# EAGLE schematic Pinscape Pico Expansion Board - DIY Friendly Main - Soldered Pico (EAGLE 7.7.0)

## Sheet 1 of 11: Main Pico
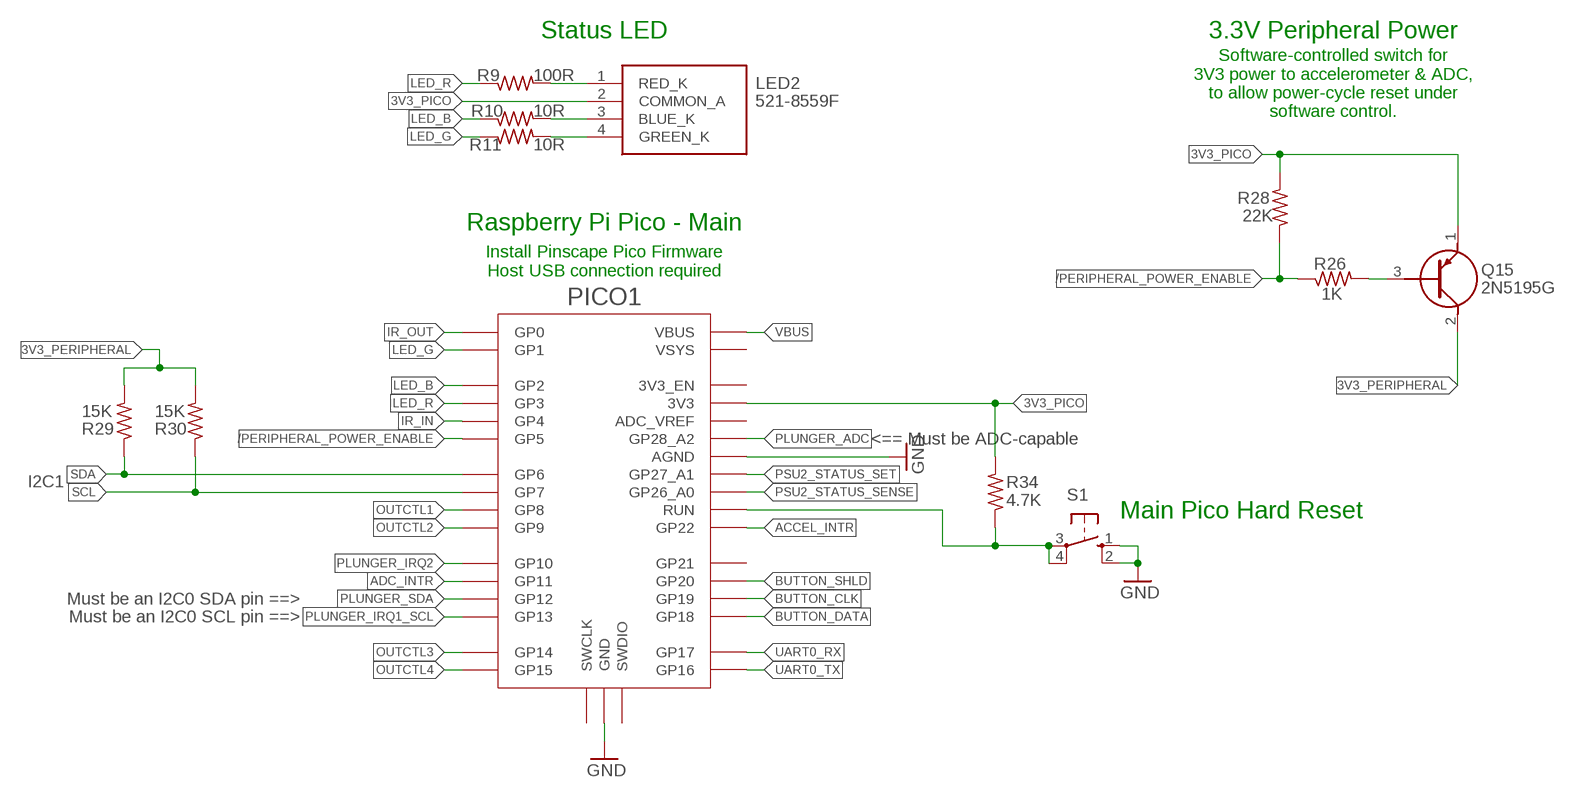
[diagram p0: schematic, sheet 1]

### Parts
LED2  521-8559F  [5218559F]
PICO1  RPI_PICO-SMD  [RPI_PICO]
Q15  2N5195G  [TO229P300X760X1364-3P]
R9  100R  R-US_0204/7  [0204/7]
R10  10R  R-US_0204/7  [0204/7]
R11  10R  R-US_0204/7  [0204/7]
R26  1K  R-US_0204/7  [0204/7]
R28  22K  R-US_0204/7  [0204/7]
R29  15K  R-US_0204/7  [0204/7]
R30  15K  R-US_0204/7  [0204/7]
R34  4.7K  R-US_0204/7  [0204/7]
S1  10-XX  [B3F-10XX]

### Nets
3V3_PERIPHERAL: Q15.2(C) R29.2 R30.2 ; also sheet 3,4,6
3V3_PICO: LED2.2(COMMON_A) PICO1.3V3 Q15.1(E) R28.2 R34.2 ; also sheet 5,6,9,10
/PERIPHERAL_POWER_ENABLE: PICO1.GP5 R26.1 R28.1 ; also sheet 2,3
ACCEL_INTR: PICO1.GP22 ; also sheet 4
ADC_INTR: PICO1.GP11 ; also sheet 6
BUTTON_CLK: PICO1.GP19 ; also sheet 5
BUTTON_DATA: PICO1.GP18 ; also sheet 5
BUTTON_SHLD: PICO1.GP20 ; also sheet 5
GND: PICO1.AGND PICO1.GND@1(GND) PICO1.GND@2(GND) PICO1.GND@3(GND) PICO1.GND@4(GND) PICO1.GND@5(GND) PICO1.GND@6(GND) PICO1.GND@7(GND) PICO1.GND@8(GND) S1.1(S) S1.2(S1) ; also sheet 2,3,4,5,6,7,8,9,10
IR_IN: PICO1.GP4 ; also sheet 9
IR_OUT: PICO1.GP0 ; also sheet 9
LED_B: PICO1.GP2 R10.1
LED_G: PICO1.GP1 R11.1
LED_R: PICO1.GP3 R9.1
N$18: LED2.1(RED_K) R9.2
N$24: Q15.3(B) R26.2
N$36: PICO1.RUN R34.1 S1.3(P) S1.4(P1)
N$37: LED2.3(BLUE_K) R10.2
N$45: LED2.4(GREEN_K) R11.2
OUTCTL1: PICO1.GP8 ; also sheet 7
OUTCTL2: PICO1.GP9 ; also sheet 7
OUTCTL3: PICO1.GP14 ; also sheet 7
OUTCTL4: PICO1.GP15 ; also sheet 7
PLUNGER_ADC: PICO1.GP28_A2 ; also sheet 6
PLUNGER_IRQ1_SCL: PICO1.GP13 ; also sheet 6
PLUNGER_IRQ2: PICO1.GP10 ; also sheet 6
PLUNGER_SDA: PICO1.GP12 ; also sheet 6
PSU2_STATUS_SENSE: PICO1.GP26_A0 ; also sheet 10
PSU2_STATUS_SET: PICO1.GP27_A1 ; also sheet 10
SCL: PICO1.GP7 R30.1 ; also sheet 2,3,4,6
SDA: PICO1.GP6 R29.1 ; also sheet 2,3,4,6
UART0_RX: PICO1.GP17 ; also sheet 3
UART0_TX: PICO1.GP16 ; also sheet 3
VBUS: PICO1.VBUS ; also sheet 2,3
Unconnected: PICO1.3V3_EN PICO1.ADC_VREF PICO1.GP21 PICO1.SWCLK PICO1.SWDIO PICO1.VSYS

### Notes on the sheet
- Status LED | 3.3V Peripheral Power
- Software-controlled switch for
  3V3 power to accelerometer & ADC,
  to allow power-cycle reset under
  software control.
- Raspberry Pi Pico - Main
- Install Pinscape Pico Firmware
  Host USB connection required
- <== Must be ADC-capable
- I2C1
- Main Pico Hard Reset
- Must be an I2C0 SDA pin ==>
- Must be an I2C0 SCL pin ==>

## Sheet 2 of 11: Worker Pico 0
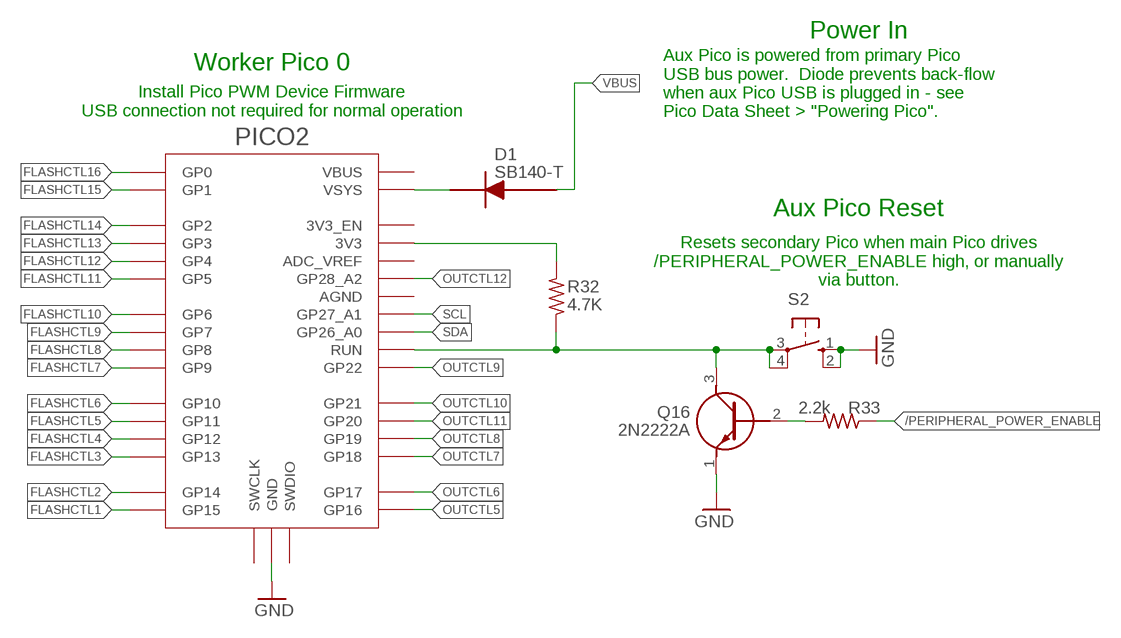
[diagram p1: schematic, sheet 2]

### Parts
D1  SB140-T  [DIOAD1408W86L464D236]
PICO2  RPI_PICO-SMD  [RPI_PICO]
Q16  2N2222A  [2N2222A]
R32  4.7K  R-US_0204/7  [0204/7]
R33  2.2k  R-US_0204/7  [0204/7]
S2  10-XX  [B3F-10XX]

### Nets
/PERIPHERAL_POWER_ENABLE: R33.1 ; also sheet 1,3
FLASHCTL1: PICO2.GP15 ; also sheet 8
FLASHCTL2: PICO2.GP14 ; also sheet 8
FLASHCTL3: PICO2.GP13 ; also sheet 8
FLASHCTL4: PICO2.GP12 ; also sheet 8
FLASHCTL5: PICO2.GP11 ; also sheet 8
FLASHCTL6: PICO2.GP10 ; also sheet 8
FLASHCTL7: PICO2.GP9 ; also sheet 8
FLASHCTL8: PICO2.GP8 ; also sheet 8
FLASHCTL9: PICO2.GP7 ; also sheet 8
FLASHCTL10: PICO2.GP6 ; also sheet 8
FLASHCTL11: PICO2.GP5 ; also sheet 8
FLASHCTL12: PICO2.GP4 ; also sheet 8
FLASHCTL13: PICO2.GP3 ; also sheet 8
FLASHCTL14: PICO2.GP2 ; also sheet 8
FLASHCTL15: PICO2.GP1 ; also sheet 8
FLASHCTL16: PICO2.GP0 ; also sheet 8
GND: PICO2.GND@1(GND) PICO2.GND@2(GND) PICO2.GND@3(GND) PICO2.GND@4(GND) PICO2.GND@5(GND) PICO2.GND@6(GND) PICO2.GND@7(GND) PICO2.GND@8(GND) Q16.1(E) S2.1(S) S2.2(S1) ; also sheet 1,3,4,5,6,7,8,9,10
N$17: D1.1(K) PICO2.VSYS
N$31: Q16.2(B) R33.2
N$34: PICO2.3V3 R32.2
N$35: PICO2.RUN Q16.3(C) R32.1 S2.3(P) S2.4(P1)
OUTCTL5: PICO2.GP16 ; also sheet 7
OUTCTL6: PICO2.GP17 ; also sheet 7
OUTCTL7: PICO2.GP18 ; also sheet 7
OUTCTL8: PICO2.GP19 ; also sheet 7
OUTCTL9: PICO2.GP22 ; also sheet 7
OUTCTL10: PICO2.GP21 ; also sheet 7
OUTCTL11: PICO2.GP20 ; also sheet 7
OUTCTL12: PICO2.GP28_A2 ; also sheet 7
SCL: PICO2.GP27_A1 ; also sheet 1,3,4,6
SDA: PICO2.GP26_A0 ; also sheet 1,3,4,6
VBUS: D1.2(A) ; also sheet 1,3
Unconnected: PICO2.3V3_EN PICO2.ADC_VREF PICO2.AGND PICO2.SWCLK PICO2.SWDIO PICO2.VBUS

### Notes on the sheet
- Power In
- Worker Pico 0
- Aux Pico is powered from primary Pico
  USB bus power.  Diode prevents back-flow
  when aux Pico USB is plugged in - see
  Pico Data Sheet > "Powering Pico".
- Install Pico PWM Device Firmware
  USB connection not required for normal operation
- Aux Pico Reset
- Resets secondary Pico when main Pico drives
  /PERIPHERAL_POWER_ENABLE high, or manually
  via button.

## Sheet 3 of 11: Misc Ports
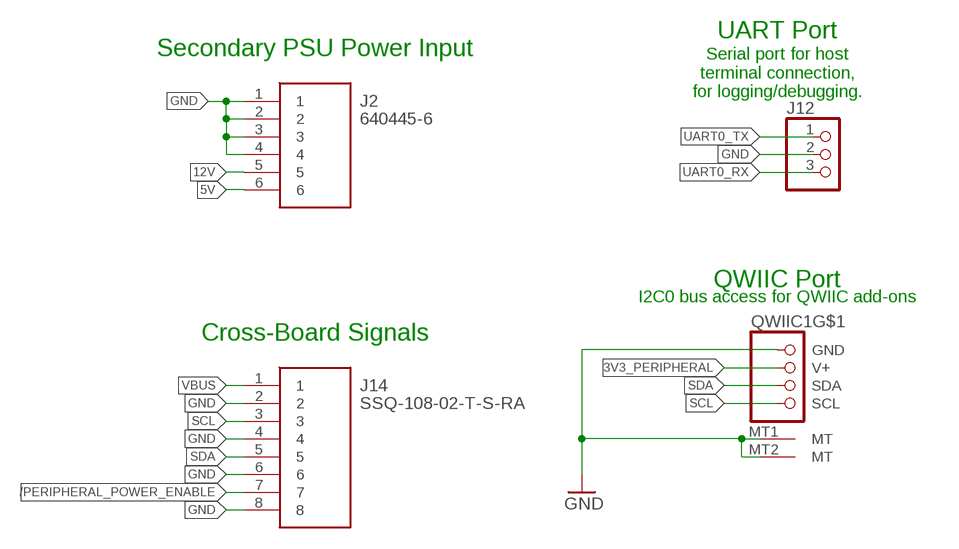
[diagram p2: schematic, sheet 3]

### Parts
J2  640445-6  [SHDR6W183P0X396_1X6_2377X762X1]
J12  PINHD-1X3  [1X03]
J14  SSQ-108-02-T-S-RA  [RHDRRA8W64P254_1X8_2083X851X24]
QWIIC1  QWIIC  STEMMA_I2C_QT  [JST_SH4]

### Nets
3V3_PERIPHERAL: QWIIC1.2(V+) ; also sheet 1,4,6
5V: J2.6 ; also sheet 6,8,9,10
12V: J2.5 ; also sheet 7
/PERIPHERAL_POWER_ENABLE: J14.7 ; also sheet 1,2
GND: J2.1 J2.2 J2.3 J2.4 J12.2 J14.2 J14.4 J14.6 J14.8 QWIIC1.1(GND) QWIIC1.MT1(MT) QWIIC1.MT2(MT) ; also sheet 1,2,4,5,6,7,8,9,10
SCL: J14.3 QWIIC1.4(SCL) ; also sheet 1,2,4,6
SDA: J14.5 QWIIC1.3(SDA) ; also sheet 1,2,4,6
UART0_RX: J12.3 ; also sheet 1
UART0_TX: J12.1 ; also sheet 1
VBUS: J14.1 ; also sheet 1,2

### Notes on the sheet
- UART Port
- Secondary PSU Power Input
- Serial port for host
  terminal connection,
  for logging/debugging.
- QWIIC Port
- I2C0 bus access for QWIIC add-ons
- Cross-Board Signals

## Sheet 4 of 11: Accelerometer
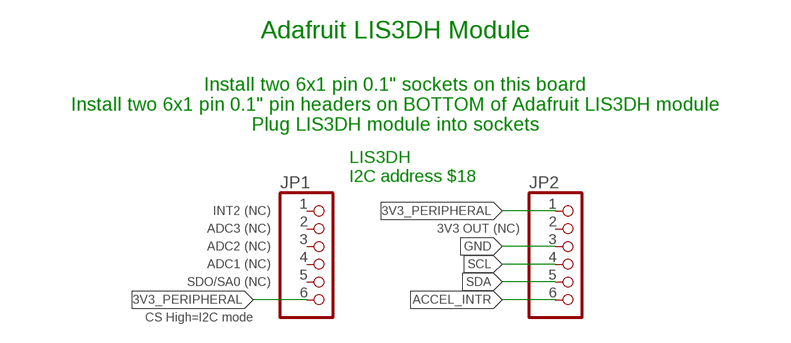
[diagram p3: schematic, sheet 4]

### Parts
JP1  PINHD-1X6  [1X06]
JP2  PINHD-1X6  [1X06]

### Nets
3V3_PERIPHERAL: JP1.6 JP2.1 ; also sheet 1,3,6
ACCEL_INTR: JP2.6 ; also sheet 1
GND: JP2.3 ; also sheet 1,2,3,5,6,7,8,9,10
SCL: JP2.4 ; also sheet 1,2,3,6
SDA: JP2.5 ; also sheet 1,2,3,6
Unconnected: JP1.1 JP1.2 JP1.3 JP1.4 JP1.5 JP2.2

### Notes on the sheet
- Adafruit LIS3DH Module
- Install two 6x1 pin 0.1" sockets on this board
  Install two 6x1 pin 0.1" pin headers on BOTTOM of Adafruit LIS3DH module
  Plug LIS3DH module into sockets
- LIS3DH
  I2C address $18
- INT2 (NC)
- ADC3 (NC) | 3V3 OUT (NC)
- ADC2 (NC)
- ADC1 (NC)
- SDO/SA0 (NC)
- CS High=I2C mode

## Sheet 5 of 11: Buttons
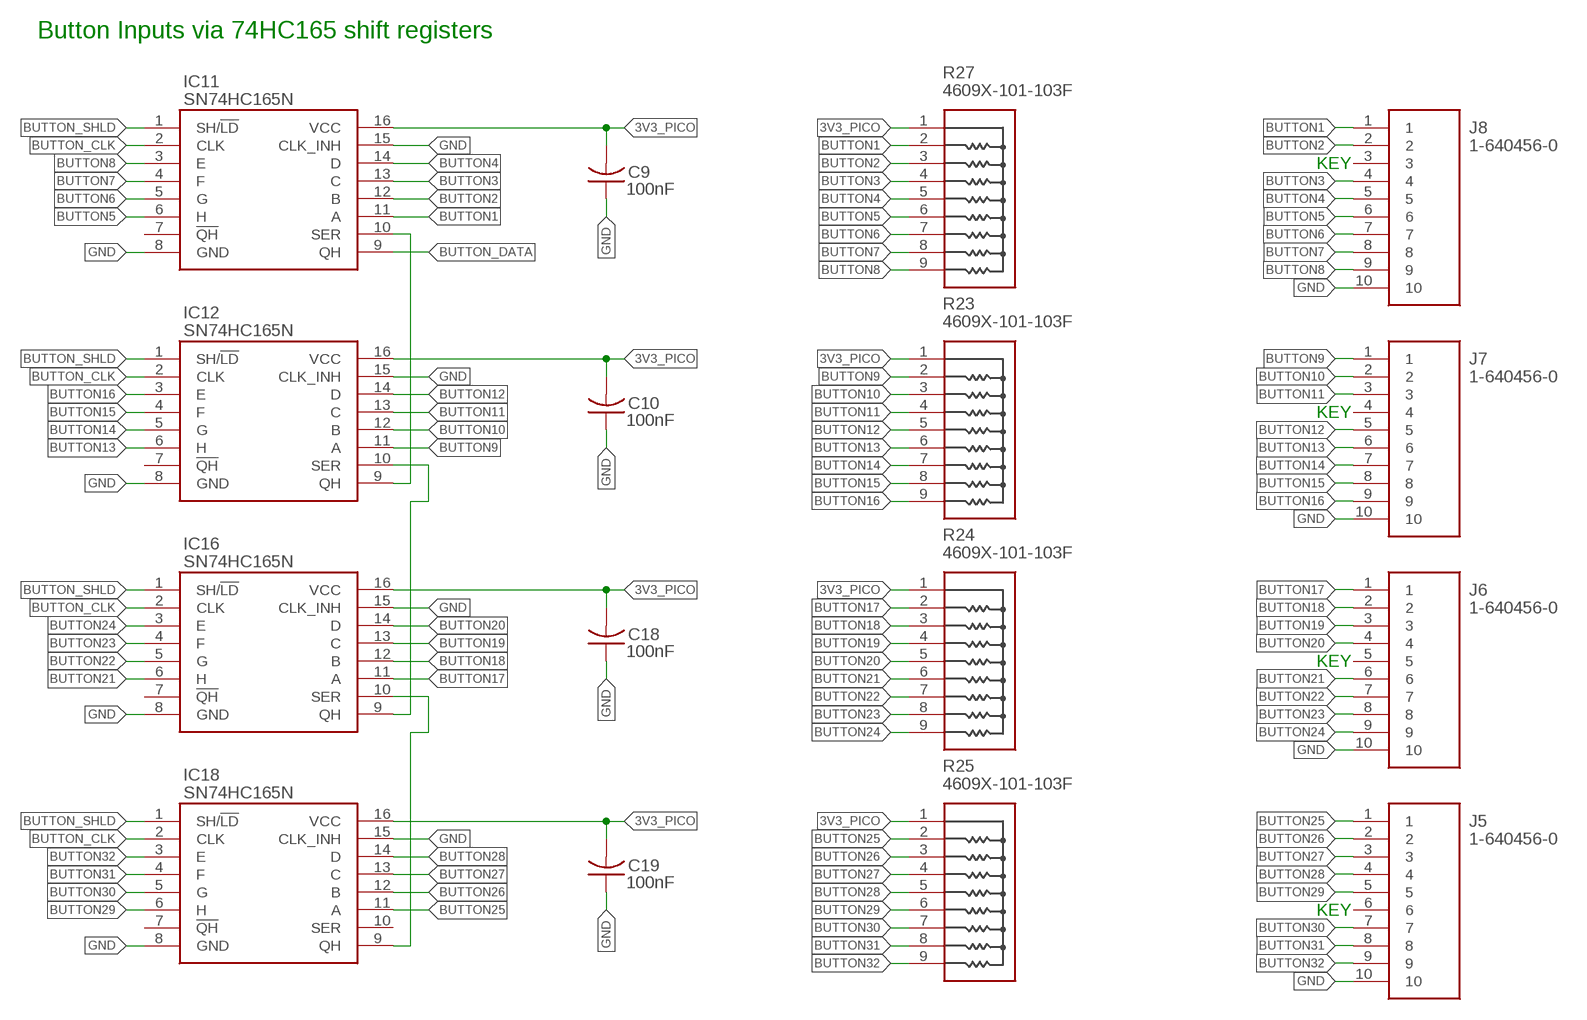
[diagram p4: schematic, sheet 5]

### Parts
C9  100nF  C-US025-024X044  [C025-024X044]
C10  100nF  C-US025-024X044  [C025-024X044]
C18  100nF  C-US025-024X044  [C025-024X044]
C19  100nF  C-US025-024X044  [C025-024X044]
IC11  SN74HC165N  [DIP794W53P254L1930H508Q16N]
IC12  SN74HC165N  [DIP794W53P254L1930H508Q16N]
IC16  SN74HC165N  [DIP794W53P254L1930H508Q16N]
IC18  SN74HC165N  [DIP794W53P254L1930H508Q16N]
J5  1-640456-0  [SHDR10W66P0X254_1X10_2540X572X]
J6  1-640456-0  [SHDR10W66P0X254_1X10_2540X572X]
J7  1-640456-0  [SHDR10W66P0X254_1X10_2540X572X]
J8  1-640456-0  [SHDR10W66P0X254_1X10_2540X572X]
R23  4609X-101-103F  4609X-101-122LF  [4609X]
R24  4609X-101-103F  4609X-101-122LF  [4609X]
R25  4609X-101-103F  4609X-101-122LF  [4609X]
R27  4609X-101-103F  4609X-101-122LF  [4609X]

### Nets
3V3_PICO: C9.2 C10.2 C18.2 C19.2 IC11.16(VCC) IC12.16(VCC) IC16.16(VCC) IC18.16(VCC) R23.1 R24.1 R25.1 R27.1 ; also sheet 1,6,9,10
BUTTON1: IC11.11(A) J8.1 R27.2
BUTTON2: IC11.12(B) J8.2 R27.3
BUTTON3: IC11.13(C) J8.4 R27.4
BUTTON4: IC11.14(D) J8.5 R27.5
BUTTON5: IC11.6(H) J8.6 R27.6
BUTTON6: IC11.5(G) J8.7 R27.7
BUTTON7: IC11.4(F) J8.8 R27.8
BUTTON8: IC11.3(E) J8.9 R27.9
BUTTON9: IC12.11(A) J7.1 R23.2
BUTTON10: IC12.12(B) J7.2 R23.3
BUTTON11: IC12.13(C) J7.3 R23.4
BUTTON12: IC12.14(D) J7.5 R23.5
BUTTON13: IC12.6(H) J7.6 R23.6
BUTTON14: IC12.5(G) J7.7 R23.7
BUTTON15: IC12.4(F) J7.8 R23.8
BUTTON16: IC12.3(E) J7.9 R23.9
BUTTON17: IC16.11(A) J6.1 R24.2
BUTTON18: IC16.12(B) J6.2 R24.3
BUTTON19: IC16.13(C) J6.3 R24.4
BUTTON20: IC16.14(D) J6.4 R24.5
BUTTON21: IC16.6(H) J6.6 R24.6
BUTTON22: IC16.5(G) J6.7 R24.7
BUTTON23: IC16.4(F) J6.8 R24.8
BUTTON24: IC16.3(E) J6.9 R24.9
BUTTON25: IC18.11(A) J5.1 R25.2
BUTTON26: IC18.12(B) J5.2 R25.3
BUTTON27: IC18.13(C) J5.3 R25.4
BUTTON28: IC18.14(D) J5.4 R25.5
BUTTON29: IC18.6(H) J5.5 R25.6
BUTTON30: IC18.5(G) J5.7 R25.7
BUTTON31: IC18.4(F) J5.8 R25.8
BUTTON32: IC18.3(E) J5.9 R25.9
BUTTON_CLK: IC11.2(CLK) IC12.2(CLK) IC16.2(CLK) IC18.2(CLK) ; also sheet 1
BUTTON_DATA: IC11.9(QH) ; also sheet 1
BUTTON_SHLD: IC11.1(SH/!LD) IC12.1(SH/!LD) IC16.1(SH/!LD) IC18.1(SH/!LD) ; also sheet 1
GND: C9.1 C10.1 C18.1 C19.1 IC11.8(GND) IC11.15(CLK_INH) IC12.8(GND) IC12.15(CLK_INH) IC16.8(GND) IC16.15(CLK_INH) IC18.8(GND) IC18.15(CLK_INH) J5.10 J6.10 J7.10 J8.10 ; also sheet 1,2,3,4,6,7,8,9,10
N$21: IC11.10(SER) IC12.9(QH)
N$22: IC12.10(SER) IC16.9(QH)
N$23: IC16.10(SER) IC18.9(QH)
Unconnected: IC11.7(!QH) IC12.7(!QH) IC16.7(!QH) IC18.7(!QH) IC18.10(SER) J5.6 J6.5 J7.4 J8.3

### Notes on the sheet
- Button Inputs via 74HC165 shift registers
- KEY
- KEY
- KEY
- KEY

## Sheet 6 of 11: Plunger
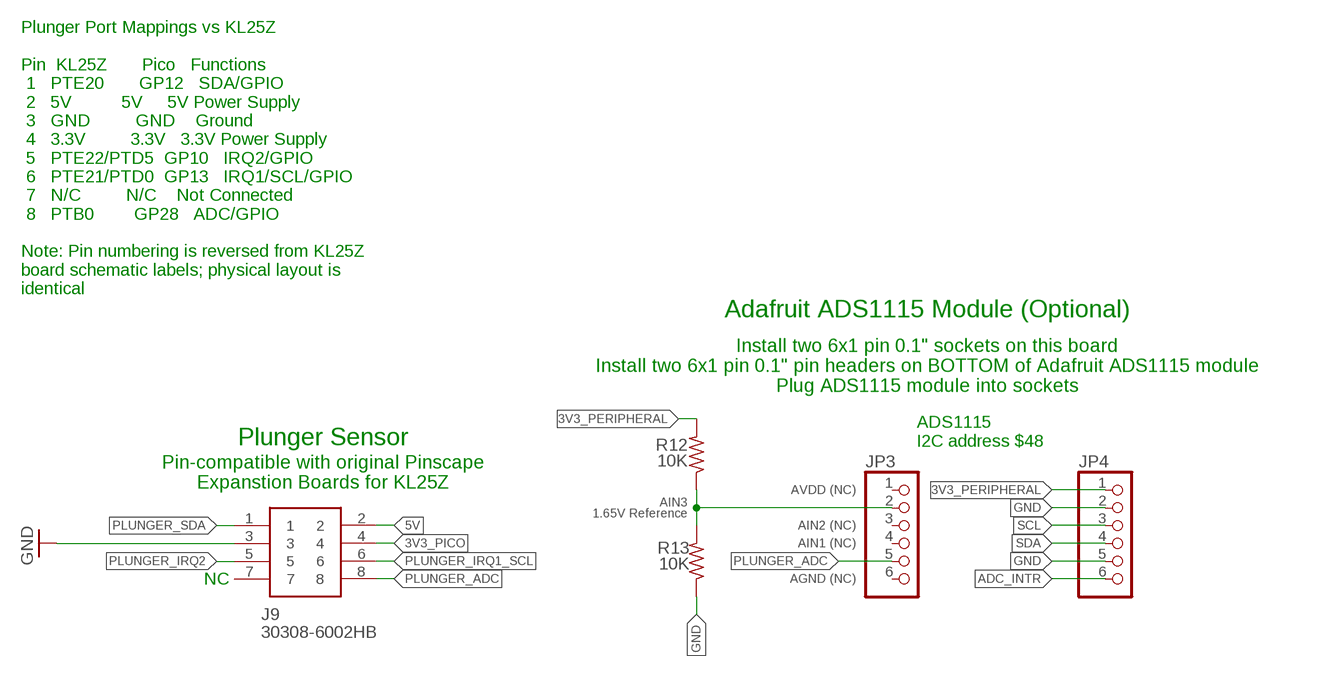
[diagram p5: schematic, sheet 6]

### Parts
J9  30308-6002HB  [SHDR8W69P254_2X4_1780X878X955P]
JP3  PINHD-1X6  [1X06]
JP4  PINHD-1X6  [1X06]
R12  10K  R-US_0204/7  [0204/7]
R13  10K  R-US_0204/7  [0204/7]

### Nets
3V3_PERIPHERAL: JP4.1 R12.2 ; also sheet 1,3,4
3V3_PICO: J9.4 ; also sheet 1,5,9,10
5V: J9.2 ; also sheet 3,8,9,10
ADC_INTR: JP4.6 ; also sheet 1
GND: J9.3 JP4.2 JP4.5 R13.1 ; also sheet 1,2,3,4,5,7,8,9,10
N$38: JP3.2 R12.1 R13.2
PLUNGER_ADC: J9.8 JP3.5 ; also sheet 1
PLUNGER_IRQ1_SCL: J9.6 ; also sheet 1
PLUNGER_IRQ2: J9.5 ; also sheet 1
PLUNGER_SDA: J9.1 ; also sheet 1
SCL: JP4.3 ; also sheet 1,2,3,4
SDA: JP4.4 ; also sheet 1,2,3,4
Unconnected: J9.7 JP3.1 JP3.3 JP3.4 JP3.6

### Notes on the sheet
- Plunger Port Mappings vs KL25Z
  
  Pin  KL25Z       Pico   Functions
   1   PTE20       GP12   SDA/GPIO
   2   5V          5V     5V Power Supply
   3   GND         GND    Ground
   4   3.3V         3.3V   3.3V Power Supply
   5   PTE22/PTD5  GP10   IRQ2/GPIO
   6   PTE21/PTD0  GP13   IRQ1/SCL/GPIO
   7   N/C         N/C    Not Connected
   8   PTB0        GP28   ADC/GPIO
  
  Note: Pin numbering is reversed from KL25Z
  board schematic labels; physical layout is
  identical
- Adafruit ADS1115 Module (Optional)
- Install two 6x1 pin 0.1" sockets on this board
  Install two 6x1 pin 0.1" pin headers on BOTTOM of Adafruit ADS1115 module
  Plug ADS1115 module into sockets
- ADS1115
  I2C address $48
- Plunger Sensor
- Pin-compatible with original Pinscape
  Expanstion Boards for KL25Z
- AVDD (NC)
- AIN3
  1.65V Reference
- AIN2 (NC)
- AIN1 (NC)
- NC | AGND (NC)

## Sheet 7 of 11: MOSFET Outputs
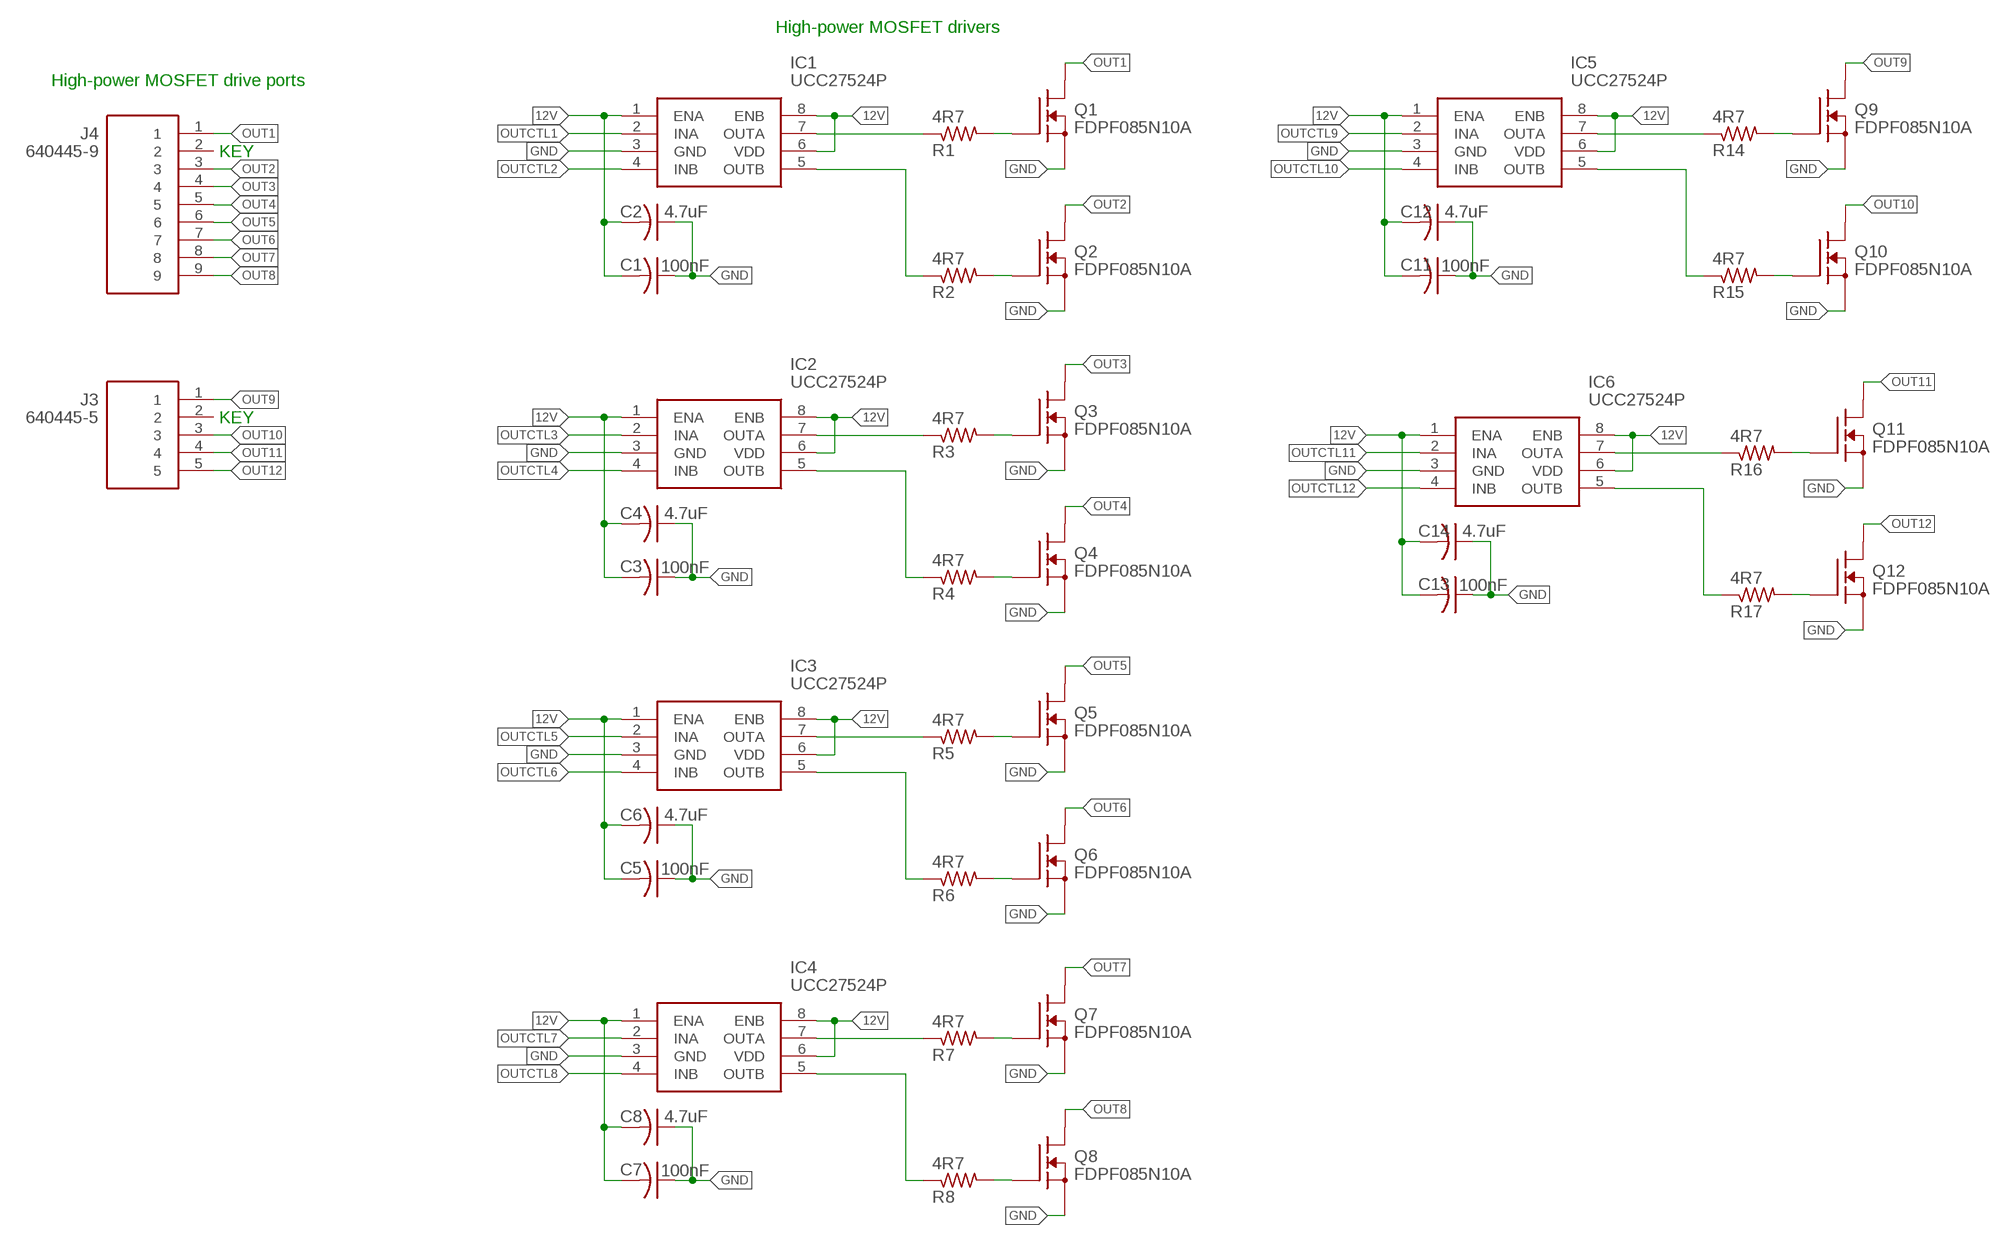
[diagram p6: schematic, sheet 7]

### Parts
C1  100nF  C-US025-024X044  [C025-024X044]
C2  4.7uF  C-US025-024X044  [C025-024X044]
C3  100nF  C-US025-024X044  [C025-024X044]
C4  4.7uF  C-US025-024X044  [C025-024X044]
C5  100nF  C-US025-024X044  [C025-024X044]
C6  4.7uF  C-US025-024X044  [C025-024X044]
C7  100nF  C-US025-024X044  [C025-024X044]
C8  4.7uF  C-US025-024X044  [C025-024X044]
C11  100nF  C-US025-024X044  [C025-024X044]
C12  4.7uF  C-US025-024X044  [C025-024X044]
C13  100nF  C-US025-024X044  [C025-024X044]
C14  4.7uF  C-US025-024X044  [C025-024X044]
IC1  UCC27524P  [DIP794W53P254L959H508Q8N]
IC2  UCC27524P  [DIP794W53P254L959H508Q8N]
IC3  UCC27524P  [DIP794W53P254L959H508Q8N]
IC4  UCC27524P  [DIP794W53P254L959H508Q8N]
IC5  UCC27524P  [DIP794W53P254L959H508Q8N]
IC6  UCC27524P  [DIP794W53P254L959H508Q8N]
J3  640445-5  [HDRV5W117P0X396_1X5_1981X762X1]
J4  640445-9  [SHDR9W117P0X396_1X9_3566X762X1]
Q1  FDPF085N10A  BUK7575-55A  [TO220BV]
Q2  FDPF085N10A  BUK7575-55A  [TO220BV]
Q3  FDPF085N10A  BUK7575-55A  [TO220BV]
Q4  FDPF085N10A  BUK7575-55A  [TO220BV]
Q5  FDPF085N10A  BUK7575-55A  [TO220BV]
Q6  FDPF085N10A  BUK7575-55A  [TO220BV]
Q7  FDPF085N10A  BUK7575-55A  [TO220BV]
Q8  FDPF085N10A  BUK7575-55A  [TO220BV]
Q9  FDPF085N10A  BUK7575-55A  [TO220BV]
Q10  FDPF085N10A  BUK7575-55A  [TO220BV]
Q11  FDPF085N10A  BUK7575-55A  [TO220BV]
Q12  FDPF085N10A  BUK7575-55A  [TO220BV]
R1  4R7  R-US_0204/5  [0204/5]
R2  4R7  R-US_0204/5  [0204/5]
R3  4R7  R-US_0204/5  [0204/5]
R4  4R7  R-US_0204/5  [0204/5]
R5  4R7  R-US_0204/5  [0204/5]
R6  4R7  R-US_0204/5  [0204/5]
R7  4R7  R-US_0204/5  [0204/5]
R8  4R7  R-US_0204/5  [0204/5]
R14  4R7  R-US_0204/5  [0204/5]
R15  4R7  R-US_0204/5  [0204/5]
R16  4R7  R-US_0204/5  [0204/5]
R17  4R7  R-US_0204/5  [0204/5]

### Nets
12V: C1.2 C2.2 C3.2 C4.2 C5.2 C6.2 C7.2 C8.2 C11.2 C12.2 C13.2 C14.2 IC1.1(ENA) IC1.6(VDD) IC1.8(ENB) IC2.1(ENA) IC2.6(VDD) IC2.8(ENB) IC3.1(ENA) IC3.6(VDD) IC3.8(ENB) IC4.1(ENA) IC4.6(VDD) IC4.8(ENB) IC5.1(ENA) IC5.6(VDD) IC5.8(ENB) IC6.1(ENA) IC6.6(VDD) IC6.8(ENB) ; also sheet 3
GND: C1.1 C2.1 C3.1 C4.1 C5.1 C6.1 C7.1 C8.1 C11.1 C12.1 C13.1 C14.1 IC1.3(GND) IC2.3(GND) IC3.3(GND) IC4.3(GND) IC5.3(GND) IC6.3(GND) Q1.3(S) Q2.3(S) Q3.3(S) Q4.3(S) Q5.3(S) Q6.3(S) Q7.3(S) Q8.3(S) Q9.3(S) Q10.3(S) Q11.3(S) Q12.3(S) ; also sheet 1,2,3,4,5,6,8,9,10
N$1: IC1.7(OUTA) R1.1
N$2: IC1.5(OUTB) R2.1
N$3: Q1.1(G) R1.2
N$4: Q2.1(G) R2.2
N$5: IC2.7(OUTA) R3.1
N$6: IC2.5(OUTB) R4.1
N$7: Q3.1(G) R3.2
N$8: Q4.1(G) R4.2
N$9: IC3.7(OUTA) R5.1
N$10: IC3.5(OUTB) R6.1
N$11: Q5.1(G) R5.2
N$12: Q6.1(G) R6.2
N$13: IC4.7(OUTA) R7.1
N$14: IC4.5(OUTB) R8.1
N$15: Q7.1(G) R7.2
N$16: Q8.1(G) R8.2
N$19: IC5.7(OUTA) R14.1
N$20: IC5.5(OUTB) R15.1
N$25: Q9.1(G) R14.2
N$26: Q10.1(G) R15.2
N$27: IC6.7(OUTA) R16.1
N$28: IC6.5(OUTB) R17.1
N$29: Q11.1(G) R16.2
N$30: Q12.1(G) R17.2
OUT1: J4.1 Q1.2(D)
OUT2: J4.3 Q2.2(D)
OUT3: J4.4 Q3.2(D)
OUT4: J4.5 Q4.2(D)
OUT5: J4.6 Q5.2(D)
OUT6: J4.7 Q6.2(D)
OUT7: J4.8 Q7.2(D)
OUT8: J4.9 Q8.2(D)
OUT9: J3.1 Q9.2(D)
OUT10: J3.3 Q10.2(D)
OUT11: J3.4 Q11.2(D)
OUT12: J3.5 Q12.2(D)
OUTCTL1: IC1.2(INA) ; also sheet 1
OUTCTL2: IC1.4(INB) ; also sheet 1
OUTCTL3: IC2.2(INA) ; also sheet 1
OUTCTL4: IC2.4(INB) ; also sheet 1
OUTCTL5: IC3.2(INA) ; also sheet 2
OUTCTL6: IC3.4(INB) ; also sheet 2
OUTCTL7: IC4.2(INA) ; also sheet 2
OUTCTL8: IC4.4(INB) ; also sheet 2
OUTCTL9: IC5.2(INA) ; also sheet 2
OUTCTL10: IC5.4(INB) ; also sheet 2
OUTCTL11: IC6.2(INA) ; also sheet 2
OUTCTL12: IC6.4(INB) ; also sheet 2
Unconnected: J3.2 J4.2

### Notes on the sheet
- High-power MOSFET drivers
- High-power MOSFET drive ports
- KEY
- KEY

## Sheet 8 of 11: Flasher Outputs
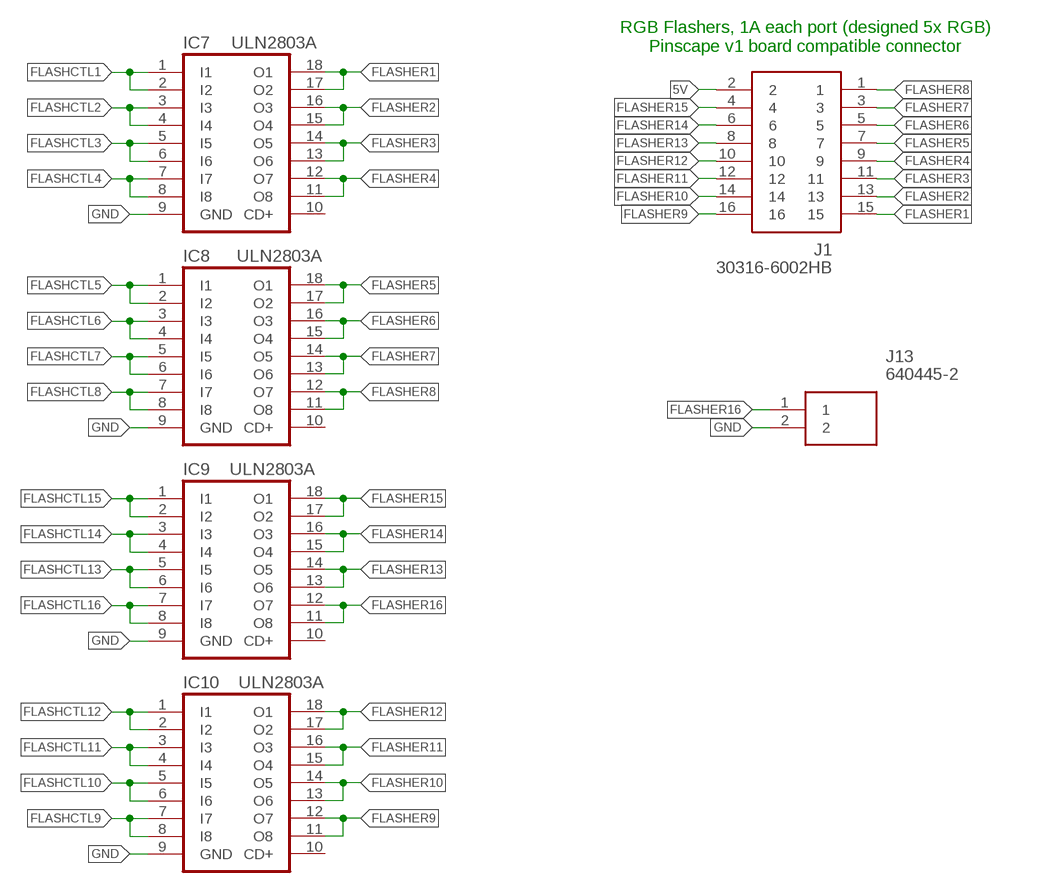
[diagram p7: schematic, sheet 8]

### Parts
IC7  ULN2803A  [DIL18]
IC8  ULN2803A  [DIL18]
IC9  ULN2803A  [DIL18]
IC10  ULN2803A  [DIL18]
J1  30316-6002HB  [3M-30316-6002HB]
J13  640445-2  [SHDR2W117P0X396_1X2_792X762X11]

### Nets
5V: J1.2 ; also sheet 3,6,9,10
FLASHCTL1: IC7.1(I1) IC7.2(I2) ; also sheet 2
FLASHCTL2: IC7.3(I3) IC7.4(I4) ; also sheet 2
FLASHCTL3: IC7.5(I5) IC7.6(I6) ; also sheet 2
FLASHCTL4: IC7.7(I7) IC7.8(I8) ; also sheet 2
FLASHCTL5: IC8.1(I1) IC8.2(I2) ; also sheet 2
FLASHCTL6: IC8.3(I3) IC8.4(I4) ; also sheet 2
FLASHCTL7: IC8.5(I5) IC8.6(I6) ; also sheet 2
FLASHCTL8: IC8.7(I7) IC8.8(I8) ; also sheet 2
FLASHCTL9: IC10.7(I7) IC10.8(I8) ; also sheet 2
FLASHCTL10: IC10.5(I5) IC10.6(I6) ; also sheet 2
FLASHCTL11: IC10.3(I3) IC10.4(I4) ; also sheet 2
FLASHCTL12: IC10.1(I1) IC10.2(I2) ; also sheet 2
FLASHCTL13: IC9.5(I5) IC9.6(I6) ; also sheet 2
FLASHCTL14: IC9.3(I3) IC9.4(I4) ; also sheet 2
FLASHCTL15: IC9.1(I1) IC9.2(I2) ; also sheet 2
FLASHCTL16: IC9.7(I7) IC9.8(I8) ; also sheet 2
FLASHER1: IC7.17(O2) IC7.18(O1) J1.15
FLASHER2: IC7.15(O4) IC7.16(O3) J1.13
FLASHER3: IC7.13(O6) IC7.14(O5) J1.11
FLASHER4: IC7.11(O8) IC7.12(O7) J1.9
FLASHER5: IC8.17(O2) IC8.18(O1) J1.7
FLASHER6: IC8.15(O4) IC8.16(O3) J1.5
FLASHER7: IC8.13(O6) IC8.14(O5) J1.3
FLASHER8: IC8.11(O8) IC8.12(O7) J1.1
FLASHER9: IC10.11(O8) IC10.12(O7) J1.16
FLASHER10: IC10.13(O6) IC10.14(O5) J1.14
FLASHER11: IC10.15(O4) IC10.16(O3) J1.12
FLASHER12: IC10.17(O2) IC10.18(O1) J1.10
FLASHER13: IC9.13(O6) IC9.14(O5) J1.8
FLASHER14: IC9.15(O4) IC9.16(O3) J1.6
FLASHER15: IC9.17(O2) IC9.18(O1) J1.4
FLASHER16: IC9.11(O8) IC9.12(O7) J13.1
GND: IC7.9(GND) IC8.9(GND) IC9.9(GND) IC10.9(GND) J13.2 ; also sheet 1,2,3,4,5,6,7,9,10
Unconnected: IC7.10(CD+) IC8.10(CD+) IC9.10(CD+) IC10.10(CD+)

### Notes on the sheet
- RGB Flashers, 1A each port (designed 5x RGB)
  Pinscape v1 board compatible connector

## Sheet 9 of 11: IR Remote
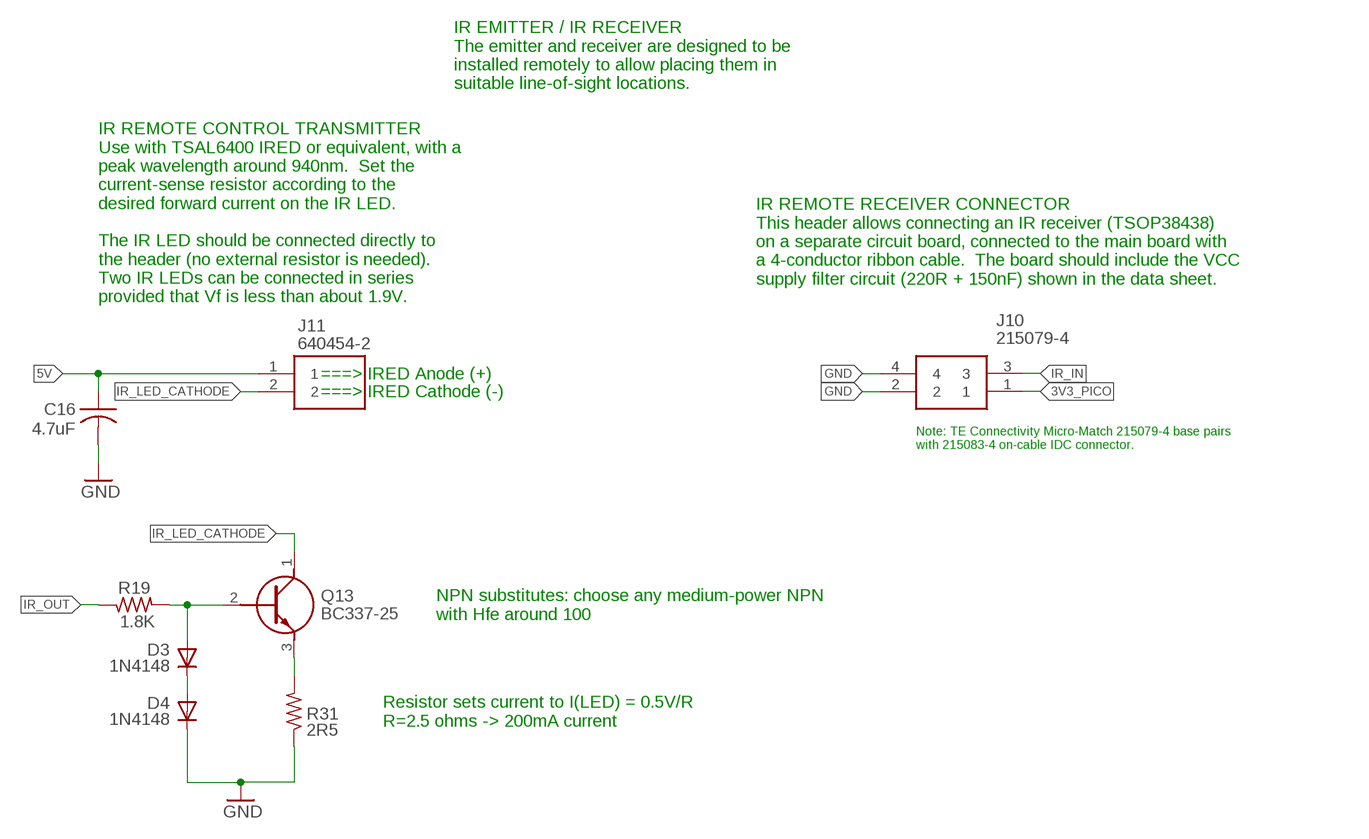
[diagram p8: schematic, sheet 9]

### Parts
C16  4.7uF  C-US025-024X044  [C025-024X044]
D3  1N4148  1N4148DO35-7  [DO35-7]
D4  1N4148  1N4148DO35-7  [DO35-7]
J10  215079-4  [2150794]
J11  640454-2  [HDRV2W66P0X254_1X2_762X572X100]
Q13  BC337-25  [BC33725]
R19  1.8K  R-US_0204/7  [0204/7]
R31  2R5  R-US_0204/7  [0204/7]

### Nets
3V3_PICO: J10.1 ; also sheet 1,5,6,10
5V: C16.1 J11.1 ; also sheet 3,6,8,10
$N377: D3.A Q13.2(B) R19.2
GND: C16.2 D4.C J10.2 J10.4 R31.1 ; also sheet 1,2,3,4,5,6,7,8,10
IR_IN: J10.3 ; also sheet 1
IR_LED_CATHODE: J11.2 Q13.1(C)
IR_OUT: R19.1 ; also sheet 1
N$32: D3.C D4.A
N$33: Q13.3(E) R31.2

### Notes on the sheet
- IR EMITTER / IR RECEIVER
  The emitter and receiver are designed to be
  installed remotely to allow placing them in
  suitable line-of-sight locations.
- IR REMOTE RECEIVER CONNECTOR
  This header allows connecting an IR receiver (TSOP38438) 
  on a separate circuit board, connected to the main board with
  a 4-conductor ribbon cable.  The board should include the VCC
  supply filter circuit (220R + 150nF) shown in the data sheet.
- IR REMOTE CONTROL TRANSMITTER
  Use with TSAL6400 IRED or equivalent, with a
  peak wavelength around 940nm.  Set the
  current-sense resistor according to the
  desired forward current on the IR LED.
  
  The IR LED should be connected directly to
  the header (no external resistor is needed).
  Two IR LEDs can be connected in series
  provided that Vf is less than about 1.9V.
- ===> IRED Anode (+)
- ===> IRED Cathode (-)
- Note: TE Connectivity Micro-Match 215079-4 base pairs
  with 215083-4 on-cable IDC connector.
- NPN substitutes: choose any medium-power NPN
  with Hfe around 100
- Resistor sets current to I(LED) = 0.5V/R
  R=2.5 ohms -> 200mA current

## Sheet 10 of 11: Power Sense
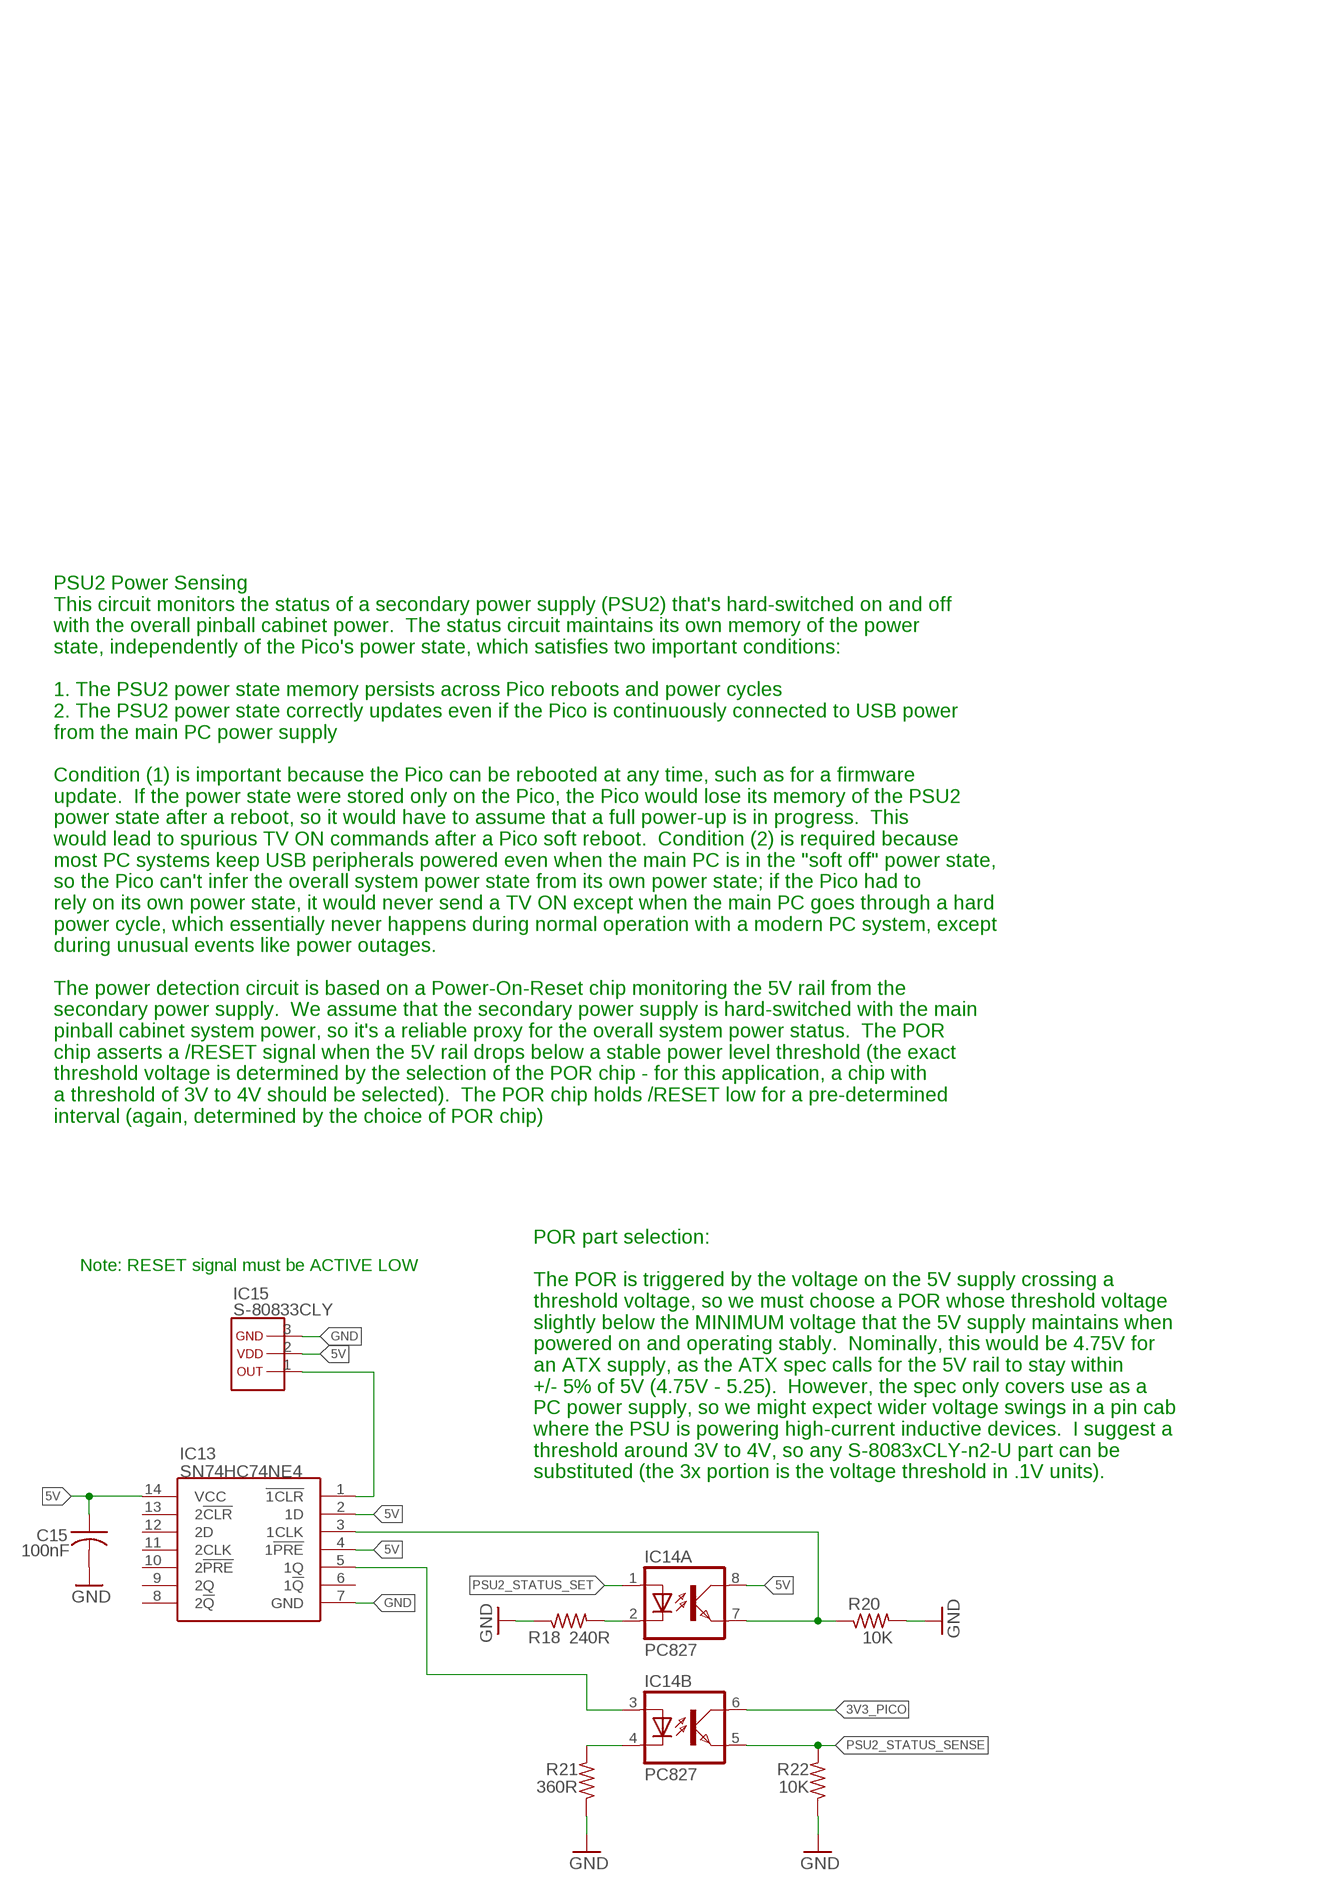
[diagram p9: schematic, sheet 10]

### Parts
C15  100nF  C-US025-024X044  [C025-024X044]
IC13  SN74HC74NE4  [DIP794W53P254L1930H508Q14N]
IC14  PC827  [DIL08]
IC15  S-80833CLY  S-80833CLY-B2-UTO92  [TO-92_(TO-226)]
R18  240R  R-US_0204/7  [0204/7]
R20  10K  R-US_0204/7  [0204/7]
R21  360R  R-US_0204/7  [0204/7]
R22  10K  R-US_0204/7  [0204/7]

### Nets
3V3_PICO: IC14.6(B:COL) ; also sheet 1,5,6,9
5V: C15.1 IC13.2(1D) IC13.4(1!PRE) IC13.14(VCC) IC14.8(A:COL) IC15.2(VDD) ; also sheet 3,6,8,9
GND: C15.2 IC13.7(GND) IC15.3(GND) R18.1 R20.2 R21.1 R22.1 ; also sheet 1,2,3,4,5,6,7,8,9
N$58: IC13.3(1CLK) IC14.7(A:EMIT) R20.1
N$59: IC14.2(A:C) R18.2
N$63: IC13.1(!1CLR) IC15.1(OUT)
N$65: IC14.4(B:C) R21.2
N$68: IC13.5(1Q) IC14.3(B:A)
PSU2_STATUS_SENSE: IC14.5(B:EMIT) R22.2 ; also sheet 1
PSU2_STATUS_SET: IC14.1(A:A) ; also sheet 1
Unconnected: IC13.6(1!Q) IC13.8(2!Q) IC13.9(2Q) IC13.10(2!PRE) IC13.11(2CLK) IC13.12(2D) IC13.13(2!CLR)

### Notes on the sheet
- PSU2 Power Sensing
  This circuit monitors the status of a secondary power supply (PSU2) that's hard-switched on and off
  with the overall pinball cabinet power.  The status circuit maintains its own memory of the power
  state, independently of the Pico's power state, which satisfies two important conditions:
  
  1. The PSU2 power state memory persists across Pico reboots and power cycles
  2. The PSU2 power state correctly updates even if the Pico is continuously connected to USB power
  from the main PC power supply
  
  Condition (1) is important because the Pico can be rebooted at any time, such as for a firmware
  update.  If the power state were stored only on the Pico, the Pico would lose its memory of the PSU2
  power state after a reboot, so it would have to assume that a full power-up is in progress.  This
  would lead to spurious TV ON commands after a Pico soft reboot.  Condition (2) is required because
  most PC systems keep USB peripherals powered even when the main PC is in the "soft off" power state,
  so the Pico can't infer the overall system power state from its own power state; if the Pico had to
  rely on its own power state, it would never send a TV ON except when the main PC goes through a hard
  power cycle, which essentially never happens during normal operation with a modern PC system, except
  during unusual events like power outages.
  
  The power detection circuit is based on a Power-On-Reset chip monitoring the 5V rail from the
  secondary power supply.  We assume that the secondary power supply is hard-switched with the main
  pinball cabinet system power, so it's a reliable proxy for the overall system power status.  The POR
  chip asserts a /RESET signal when the 5V rail drops below a stable power level threshold (the exact
  threshold voltage is determined by the selection of the POR chip - for this application, a chip with
  a threshold of 3V to 4V should be selected).  The POR chip holds /RESET low for a pre-determined
  interval (again, determined by the choice of POR chip) after the rail rises above the threshold
  voltage, and then takes /RESET high to indicate that power is stable.  The detector circuit uses
  /RESET as a signal to clear the flip-flop to logic '0' state - this is where the memory of the power
  state is stored.  The flip-flop's output (Q) is connected to a Pico GPIO, PSU2_STATUS_SENSE,
  through an optocoupler; this serves to isolate the flip-flop's 5V system from the Pico's 3.3V system.
  When the 5V power is off, the Q output will read as low simply by virtue of not being powered, so
  the opto will be off, and PSU2_STATUS_SENSE will be pulled to GND and thus will read as logic '0'.
  When the 5V power initially comes on, the POR /RESET signal will ensure that Q is still held at
  logic '0', so the Pico will continue to see logic '0' on the opto output.  So the Pico will see a
  logic '0' continuously as long as 5V power is out, AND after 5V power returns, until the flip-flop
  state is explicitly updated.  The Pico has a second GPIO, PSU2_STATUS_SET, that sends a signal to
  the flip-flop.  This signal is also mediated through an optocoupler interface between the 3.3V and
  5V power systems, translating the 3.3V signal to 5V in positive logic.  This signal leads to the
  flip-flop clock input.  When the Pico toggles the flip-flop clock high, the flip-flop loads the D
  input, which is hard-wired to a high level logic '1', to its Q output.  This is the action that
  SETS the power state memory.
  
  The software uses this by polling PSU2_STATUS_SENSE.  If this reads as logic '1', it means that 5V
  power (and thus overall pin cab system power) has been ON continuously since the last poll, so no
  power-cycle action is required.  If it reads as '0', it means that 5V power is either OFF right now,
  OR that a main system power cycle has occurred since the last update, and power is back on now.  The
  software can distinguish these two cases by toggling PSU_STATUS_SET to '1' briefly and then back to
  '0', and then reading PSU2_STATUS_SENSE again.  If 5V power is OFF, the flip-flop isn't powered, so
  the SET operation will have no effect, and PSU2_STATUS_SENSE will still read as '0'.  If 5V power
  is ON, the flip-flop will carry out the SET operation, and PSU2_STATUS_SENSE will now read as '1'.
  When this transition occurs, the software knows that a power cycle has occurred since the last
  update, so it should carry out the power-on actions (e.g., sending the TV ON signals).
- Note: RESET signal must be ACTIVE LOW
- POR part selection:
  
  The POR is triggered by the voltage on the 5V supply crossing a
  threshold voltage, so we must choose a POR whose threshold voltage
  slightly below the MINIMUM voltage that the 5V supply maintains when
  powered on and operating stably.  Nominally, this would be 4.75V for
  an ATX supply, as the ATX spec calls for the 5V rail to stay within
  +/- 5% of 5V (4.75V - 5.25).  However, the spec only covers use as a
  PC power supply, so we might expect wider voltage swings in a pin cab
  where the PSU is powering high-current inductive devices.  I suggest a
  threshold around 3V to 4V, so any S-8083xCLY-n2-U part can be
  substituted (the 3x portion is the voltage threshold in .1V units).

## Sheet 11 of 11: Notes
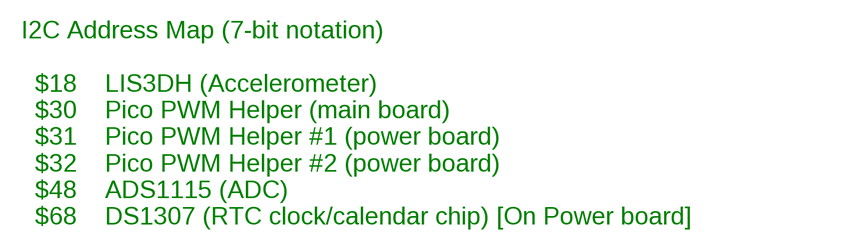
[diagram p10: schematic, sheet 11]

### Notes on the sheet
- I2C Address Map (7-bit notation)
  
    $18    LIS3DH (Accelerometer)
    $30    Pico PWM Helper (main board)
    $31    Pico PWM Helper #1 (power board)
    $32    Pico PWM Helper #2 (power board)
    $48    ADS1115 (ADC)
    $68    DS1307 (RTC clock/calendar chip) [On Power board]

## Library data of the parts
C1 C3 C5 C7 C9-C11 C13 C15 C18 C19 = rcl:C-US: CAPACITOR, American symbol; PARTNO: 21RZ310-RC
C2 C4 C6 C8 C12 C14 C16 = rcl:C-US: CAPACITOR, American symbol; PARTNO: 810-FG14X5R1H475KRT0
D1 = SamacSys_Parts:SB140-T: Schottky Diodes & Rectifiers 1.0A 40V Source: Datasheet <https://www.arrow.com/en/products/sb140-t/diodes-incorporated>; DESCRIPTION: Schottky Diodes & Rectifiers 1.0A 40V; HEIGHT: mm; MANUFACTURER_NAME: Diodes Incorporated; MANUFACTURER_PART_NUMBER: SB140-T; MOUSER_PART_NUMBER: 621-SB140-T; MOUSER_PRICE-STOCK: https://www.mouser.co.uk/ProductDetail/Diodes-Incorporated/SB140-T?qs=sxN%252BoM2fis8H2rSIUCd%252Bfg%3D%3D
D3 D4 = diode:1N4148: DIODE high speed (Philips)
IC1-IC6 = SamacSys_Parts:UCC27524P: Dual, 5A, High-Speed Low-Side Power MOSFET Driver Source: Datasheet <http://www.ti.com/lit/gpn/ucc27524>; DESCRIPTION: Dual, 5A, High-Speed Low-Side Power MOSFET Driver; HEIGHT: 5.08mm; MANUFACTURER_NAME: Texas Instruments; MANUFACTURER_PART_NUMBER: UCC27524P; MOUSER_PART_NUMBER: 595-UCC27524P; MOUSER_PRICE-STOCK: https://www.mouser.co.uk/ProductDetail/Texas-Instruments/UCC27524P?qs=iuXUNOC6nYeLYu3RiGlNsQ%3D%3D
IC7-IC10 = uln-udn:ULN2803A: DRIVER ARRAY
IC11 IC12 IC16 IC18 = SamacSys_Parts:SN74HC165N: 8-BIT PARALLEL-LOAD SHIFT REGISTERS Source: Datasheet <http://componentsearchengine.com/Datasheets/3/SN74HC165N.pdf>; DESCRIPTION: 8-BIT PARALLEL-LOAD SHIFT REGISTERS; HEIGHT: 5.08mm; MANUFACTURER_NAME: Texas Instruments; MANUFACTURER_PART_NUMBER: SN74HC165N; MOUSER_PART_NUMBER: 595-SN74HC165N; MOUSER_PRICE-STOCK: https://www.mouser.co.uk/ProductDetail/Texas-Instruments/SN74HC165N?qs=bvpNxolhIUPhyI98TAZx%2Fg%3D%3D
IC13 = SamacSys_Parts:SN74HC74NE4: Flip Flop D-Type Pos-Edge 2-Element 14-Pin PDIP Tube Source: Datasheet <https://www.arrow.com/en/products/sn74hc74ne4/texas-instruments>; DESCRIPTION: Flip Flop D-Type Pos-Edge 2-Element 14-Pin PDIP Tube; HEIGHT: 5.08mm; MANUFACTURER_NAME: Texas Instruments; MANUFACTURER_PART_NUMBER: SN74HC74NE4; MOUSER_PART_NUMBER: 595-SN74HC74NE4; MOUSER_PRICE-STOCK: https://www.mouser.co.uk/ProductDetail/Texas-Instruments/SN74HC74NE4?qs=AgY10sKTvDKeNkeCRvMUaQ%3D%3D
IC14 = optocoupler:PC827: SHARP OPTO COUPLER; OC_FARNELL: unknown; OC_NEWARK: unknown
IC15 = SamacSys_Parts:S-80833CLY-B2-U: S80833CLY-B2-U voltage detector
J1 = SamacSys_Parts:30316-6002HB: Low Profile Header Source: Datasheet <https://datasheet.datasheetarchive.com/originals/distributors/Datasheets-DGA21/2082104.pdf>; DESCRIPTION: Low Profile Header; HEIGHT: mm; MANUFACTURER_NAME: 3M; MANUFACTURER_PART_NUMBER: 30316-6002HB; MOUSER_PART_NUMBER: 517-30316-6002; MOUSER_PRICE-STOCK: https://www.mouser.co.uk/ProductDetail/3M-Electronic-Solutions-Division/30316-6002HB?qs=QV10cN0MjFtE79zTqp0XZw%3D%3D
J2 = SamacSys_Parts:640445-6: 6 way friction lock header,3.96mm pitch Source: Datasheet <https://componentsearchengine.com/Datasheets/1/640445-6.pdf>; DESCRIPTION: 6 way friction lock header,3.96mm pitch; HEIGHT: 11.049mm; MANUFACTURER_NAME: TE Connectivity; MANUFACTURER_PART_NUMBER: 640445-6; MOUSER_PART_NUMBER: 571-6404456; MOUSER_PRICE-STOCK: https://www.mouser.com/Search/Refine.aspx?Keyword=571-6404456
J3 = SamacSys_Parts:640445-5: Headers & Wire Housings FRCTN LK HDR STR 5P Square post tin Source: Datasheet <https://www.te.com/commerce/DocumentDelivery/DDEController?Action=showdoc&DocId=Customer Drawing640445AD5pdfEnglishENG_CD_640445_AD5.pdf640445-5>; DESCRIPTION: Headers & Wire Housings FRCTN LK HDR STR 5P Square post tin; HEIGHT: 13.716mm; MANUFACTURER_NAME: TE Connectivity; MANUFACTURER_PART_NUMBER: 640445-5; MOUSER_PART_NUMBER: 571-640445-5; MOUSER_PRICE-STOCK: https://www.mouser.co.uk/ProductDetail/TE-Connectivity/640445-5?qs=P8zzrVhehateG3JS5ZzrEg%3D%3D
J4 = SamacSys_Parts:640445-9: Header,MTA156,straight,3.96mm,9way Source: Datasheet <https://www.te.com/commerce/DocumentDelivery/DDEController?Action=srchrtrv&DocNm=82056_MTA&DocType=Data Sheet&DocLang=English&PartCntxt=640445-9&DocFormat=pdf>; DESCRIPTION: Header,MTA156,straight,3.96mm,9way; HEIGHT: 13.716mm; MANUFACTURER_NAME: TE Connectivity; MANUFACTURER_PART_NUMBER: 640445-9; MOUSER_PART_NUMBER: 571-6404459; MOUSER_PRICE-STOCK: https://www.mouser.co.uk/ProductDetail/TE-Connectivity/640445-9?qs=P8zzrVhehauUywCYO3wBKg%3D%3D
J5-J8 = SamacSys_Parts:1-640456-0: 10 way MTA straight friction lock header Source: Datasheet <https://datasheet.datasheetarchive.com/originals/distributors/Datasheets_SAMA/53b6d75d7446c4158b7609f45acef8cd.pdf>; DESCRIPTION: 10 way MTA straight friction lock header; HEIGHT: 10.414mm; MANUFACTURER_NAME: TE Connectivity; MANUFACTURER_PART_NUMBER: 1-640456-0; MOUSER_PART_NUMBER: 571-16404560; MOUSER_PRICE-STOCK: https://www.mouser.co.uk/ProductDetail/TE-Connectivity-AMP/1-640456-0?qs=%2F35zJ5USjomFMMbv03PGrg%3D%3D
J9 = SamacSys_Parts:30308-6002HB: Headers & Wire Housings 8/HDR/LP/ BX/STR/CS/.110/AU FL Source: Datasheet <http://multimedia.3m.com/mws/media/22504O/3mtm-100-in-loprof-hdr-100x-100strt-ra-4-wall-ts0818.pdf>; DESCRIPTION: Headers & Wire Housings 8/HDR/LP/ BX/STR/CS/.110/AU FL; HEIGHT: 9.554mm; MANUFACTURER_NAME: 3M; MANUFACTURER_PART_NUMBER: 30308-6002HB
J10 = SamacSys_Parts:215079-4: Connector,F-o-B,PCB,Micro-MaTch,4W,top Source: Datasheet <https://www.te.com/commerce/DocumentDelivery/DDEController?Action=srchrtrv&DocNm=215079&DocType=Customer Drawing&DocLang=English>; DESCRIPTION: Connector,F-o-B,PCB,Micro-MaTch,4W,top; HEIGHT: 4.2mm; MANUFACTURER_NAME: TE Connectivity; MANUFACTURER_PART_NUMBER: 215079-4; MOUSER_PART_NUMBER: 571-215079-4; MOUSER_PRICE-STOCK: https://www.mouser.co.uk/ProductDetail/TE-Connectivity/215079-4?qs=O3N86PA0UL%252BdoZEVcFx8sQ%3D%3D
J11 = SamacSys_Parts:640454-2: 2 way MTA straight polarised header TE Connectivity MTA-100 Series, 2.54mm Pitch 2 Way 1 Row Straight PCB Header, Solder Termination, 5A Source: Datasheet <https://datasheet.datasheetarchive.com/originals/distributors/Datasheets_SAMA/0152b3901a0ba380c7a54e62cba96e15.pdf>; DESCRIPTION: 2 way MTA straight polarised header TE Connectivity MTA-100 Series, 2.54mm Pitch 2 Way 1 Row Straight PCB Header, Solder Termination, 5A; HEIGHT: 10.03mm; MANUFACTURER_NAME: TE Connectivity; MANUFACTURER_PART_NUMBER: 640454-2; MOUSER_PART_NUMBER: 571-640454-2; MOUSER_PRICE-STOCK: https://www.mouser.co.uk/ProductDetail/TE-Connectivity/640454-2?qs=%2F35zJ5USjomXuMPFoVTCPQ%3D%3D
J12 = pinhead:PINHD-1X3: PIN HEADER
J13 = SamacSys_Parts:640445-2: 2 way friction lock header,3.96mm pitch TE Connectivity MTA-156 Series, 3.96mm Pitch 2 Way 1 Row Straight PCB Header, Through Hole, Solder Termination Source: Datasheet <https://componentsearchengine.com/Datasheets/2/640445-2.pdf>; DESCRIPTION: 2 way friction lock header,3.96mm pitch TE Connectivity MTA-156 Series, 3.96mm Pitch 2 Way 1 Row Straight PCB Header, Through Hole, Solder Termination; HEIGHT: 11.049mm; MANUFACTURER_NAME: TE Connectivity; MANUFACTURER_PART_NUMBER: 640445-2; MOUSER_PART_NUMBER: 5716404452; MOUSER_PRICE-STOCK: https://www.mouser.co.uk/ProductDetail/TE-Connectivity-AMP/640445-2?qs=P8zzrVhehau7EdfErby3cQ%3D%3D
J14 = SamacSys_Parts:SSQ-108-02-T-S-RA: SOCKET STRIP,2.54mm,Single Row,8 Pos Source: Datasheet <http://suddendocs.samtec.com/catalog_english/ssq_th.pdf>; DESCRIPTION: SOCKET STRIP,2.54mm,Single Row,8 Pos; HEIGHT: 2.41mm; MANUFACTURER_NAME: SAMTEC; MANUFACTURER_PART_NUMBER: SSQ-108-02-T-S-RA; MOUSER_PART_NUMBER: 200-SSQ10802TSRA; MOUSER_PRICE-STOCK: https://www.mouser.co.uk/ProductDetail/Samtec/SSQ-108-02-T-S-RA?qs=rU5fayqh%252BE2lKv1YfhSTPw%3D%3D
JP1-JP4 = pinhead:PINHD-1X6: PIN HEADER
LED2 = SamacSys_Parts:521-8559F: Standard LEDs - Through Hole 5mm RGB WC LED w4 leads Source: Datasheet; DESCRIPTION: Standard LEDs - Through Hole 5mm RGB WC LED w4 leads; HEIGHT: 8.6mm; MANUFACTURER_NAME: Dialight; MANUFACTURER_PART_NUMBER: 521-8559F; MOUSER_PART_NUMBER: 645-5218559F; MOUSER_PRICE-STOCK: https://www.mouser.co.uk/ProductDetail/Dialight/521-8559F?qs=vmHwEFxEFR%2FyCJVY9sdZTA%3D%3D
PICO1 PICO2 = RaspberryPi_Pico:RPI_PICO
Q1-Q12 = BUK7575:BUK7575-55A; PARTNO: FDPF085N10A
Q13 = SamacSys_Parts:BC337-25: Trans GP BJT NPN 45V 0.8A 625mW 3-Pin TO-92 Ammo Source: Datasheet <https://www.onsemi.com/pdf/datasheet/bc337-d.pdf>; DESCRIPTION: Trans GP BJT NPN 45V 0.8A 625mW 3-Pin TO-92 Ammo; HEIGHT: 5.33mm; MANUFACTURER_NAME: Diotec; MANUFACTURER_PART_NUMBER: BC337-25; MOUSER_PART_NUMBER: 637-BC337-25; MOUSER_PRICE-STOCK: https://www.mouser.co.uk/ProductDetail/Diotec-Semiconductor/BC337-25?qs=OlC7AqGiEDnYgKdQ87b9GA%3D%3D
Q15 = SamacSys_Parts:2N5195G: ON SEMICONDUCTOR - 2N5195G - Bipolar (BJT) Single Transistor, General Purpose, PNP, -80 V, 2 MHz, 40 W, -4 A, 80 hFE Source: Datasheet <http://www.onsemi.com/pub/Collateral/2N5194-D.PDF>; DESCRIPTION: ON SEMICONDUCTOR - 2N5195G - Bipolar (BJT) Single Transistor, General Purpose, PNP, -80 V, 2 MHz, 40 W, -4 A, 80 hFE; HEIGHT: 3mm; MANUFACTURER_NAME: onsemi; MANUFACTURER_PART_NUMBER: 2N5195G; MOUSER_PART_NUMBER: 863-2N5195G; MOUSER_PRICE-STOCK: https://www.mouser.co.uk/ProductDetail/ON-Semiconductor/2N5195G?qs=vLkC5FC1VN%252B%2FeNbeVgxufg%3D%3D
Q16 = SamacSys_Parts:2N2222A: NPN General purpose transistor . IC 150 mA . f 100 MHz Source: Datasheet <https://diotec.com/request/datasheet/2n2222a.pdf>; DESCRIPTION: NPN General purpose transistor . IC 150 mA . f 100 MHz; HEIGHT: 7.5mm; MANUFACTURER_NAME: Diotec; MANUFACTURER_PART_NUMBER: 2N2222A; MOUSER_PART_NUMBER: 637-2N2222A; MOUSER_PRICE-STOCK: https://www.mouser.co.uk/ProductDetail/Diotec-Semiconductor/2N2222A?qs=OlC7AqGiEDmNlRSTGL2dYg%3D%3D
QWIIC1 = microbuilder:STEMMA_I2C
R1-R22 R26 R28-R34 = resistor:R-US_: RESISTOR, American symbol; PARTNO: 660-MFS1/4DCT52R47R0
R23-R25 R27 = SamacSys_Parts - backup:4609X-101-122LF: Bourns 4600X Series 1.2k Bussed Resistor Network, 8 Resistors, 1.13W total SIP Package Pin Source: Datasheet <http://www.bourns.com/pdfs/4600x.pdf>; DESCRIPTION: Bourns 4600X Series 1.2k Bussed Resistor Network, 8 Resistors, 1.13W total SIP Package Pin; HEIGHT: mm; MANUFACTURER_NAME: Bourns; MANUFACTURER_PART_NUMBER: 4609X-101-122LF; MOUSER_PART_NUMBER: 652-4609X-1LF-1.2K; MOUSER_PRICE-STOCK: https://www.mouser.co.uk/ProductDetail/Bourns/4609X-101-122LF?qs=XW6UEr546KJvfpyYRaJ6yw%3D%3D
S1 S2 = switch-omron:10-XX: OMRON SWITCH; MPN: B3F-1000; OC_FARNELL: 176432; OC_NEWARK: 36M3542

## Net classes
1 highpower: width 0.305 mm, drill 0.483 mm